# Altium schematic sheet rfid.SchDoc
size A
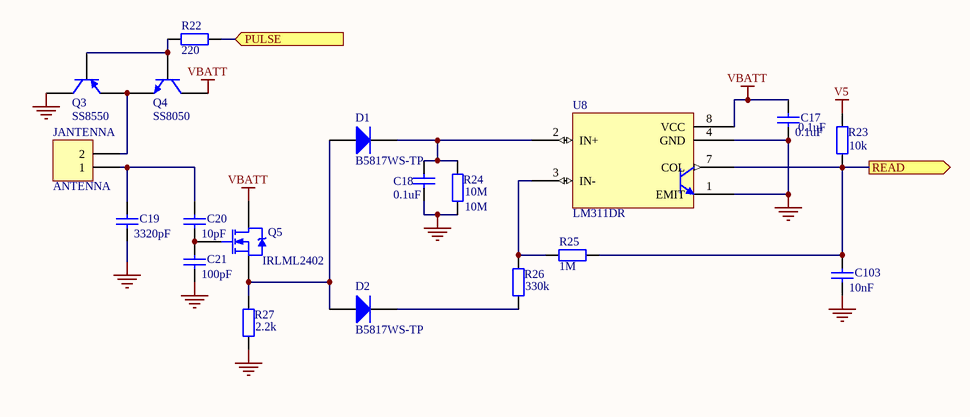
[diagram p0: rfid.SchDoc]

## Parts
C17  0.1uF  [CAPC2012L]
C18  0.1uF  [CAPC1608L]
C19  3320pF  [CAPC1608L]
C20  10pF  [CAPC1608L]
C21  100pF  [CAPC1608L]
C103  10nF  [CAPC1608L]
D1  B5817WS-TP  [SOD_323]
D2  B5817WS-TP  [SOD_323]
JANTENNA  ANTENNA  [HDR1X2]
Q3  SS8550  [SOT23_BJT]
Q4  SS8050  [SOT23_BJT]
Q5  IRLML2402  [SOT-23_N]
R22  value 220  [RESC1608L]  (hidden comment: 2.2k)
R23  10k  [RESC1608L]
R24  10M  [RESC1608L]
R25  1M  [RESC1608L]
R26  330k  [RESC1608L]
R27  2.2k  [RESC1608L]
U8  LM311DR  [LM311DR]

## Ports
PULSE (in), READ (out)

## Nets
GND: C17.2 C18.1 C19.1 C21.1 C103.1 Q3.C R24.2 R27.2 U8.1(EMIT) U8.4(GND)
V5: R23.1
VBATT: C17.1 Q4.C Q5.3(D) U8.8(VCC)
PULSE: R22.2 ; port PULSE
READ: C103.2 R23.2 R25.2 U8.7(COL) ; port READ
NetC18_2: C18.2 D1.2 R24.1 U8.2(IN+)
NetC19_2: C19.2 C20.2 JANTENNA.1
NetC20_1: C20.1 C21.2 Q5.1(G)
NetD1_1: D1.1 D2.1 Q5.2(S) R27.1
NetD2_2: D2.2 R26.2
NetJANTENNA_2: JANTENNA.2 Q3.E Q4.E
NetQ3_B: Q3.B Q4.B R22.1
NetR25_1: R25.1 R26.1 U8.3(IN-)

## Library data of the parts
C17-C21 C103 = Cap: Capacitor; Published: 8-Jun-2000; LatestRevisionDate: 17-Jul-2002; LatestRevisionNote: Re-released for DXP Platform.; PackageReference: RAD-0.3; Publisher: Altium Limited
  C17 C18: PackageDescription: Radial Cap, Thru-Hole; 2 Leads; 0.3 in Pin Spacing; Value: 0.1uF
  C19: Value: 3320pF
  C20: Value: 10pF
  C21: Value: 100pF
  C103: Value: 10nF
JANTENNA = Header 2: Header, 2-Pin; LatestRevisionDate: 17-Jul-2002; LatestRevisionNote: Re-released for DXP Platform.; Publisher: Altium Limited
Q5 = IRLML2402: HEXFET Power MOSFET; Published: 8-Jun-2000; LatestRevisionDate: 20-Nov-2009; LatestRevisionNote: IPC-7351 Footprint Added.; DatasheetVersion: Aug-1997; PackageReference: SOT-23; Publisher: Altium Limited; PackageDescription: 3-Pin SOT-23 Package 0.95 mm Pitch, 2.3 mm Lead Span; ComponentLink1Description: Manufacturer Link; ComponentLink1URL: http://www.irf.com/; ComponentLink2Description: Datasheet; ComponentLink2URL: http://www.irf.com/product-info/datasheets/data/irlml2402.pdf
R22-R27 = Res2: Resistor; Published: 8-Jun-2000; LatestRevisionDate: 17-Jul-2002; LatestRevisionNote: Re-released for DXP Platform.; PackageReference: AXIAL-0.4; Publisher: Altium Limited
  R23: Value: 10k
  R24: Value: 10M
  R25: Value: 1M
  R26: Value: 330k
  R27: Value: 2.2k